# EAGLE design rp2040 solder kit v0.1 (EAGLE 9.5.2)
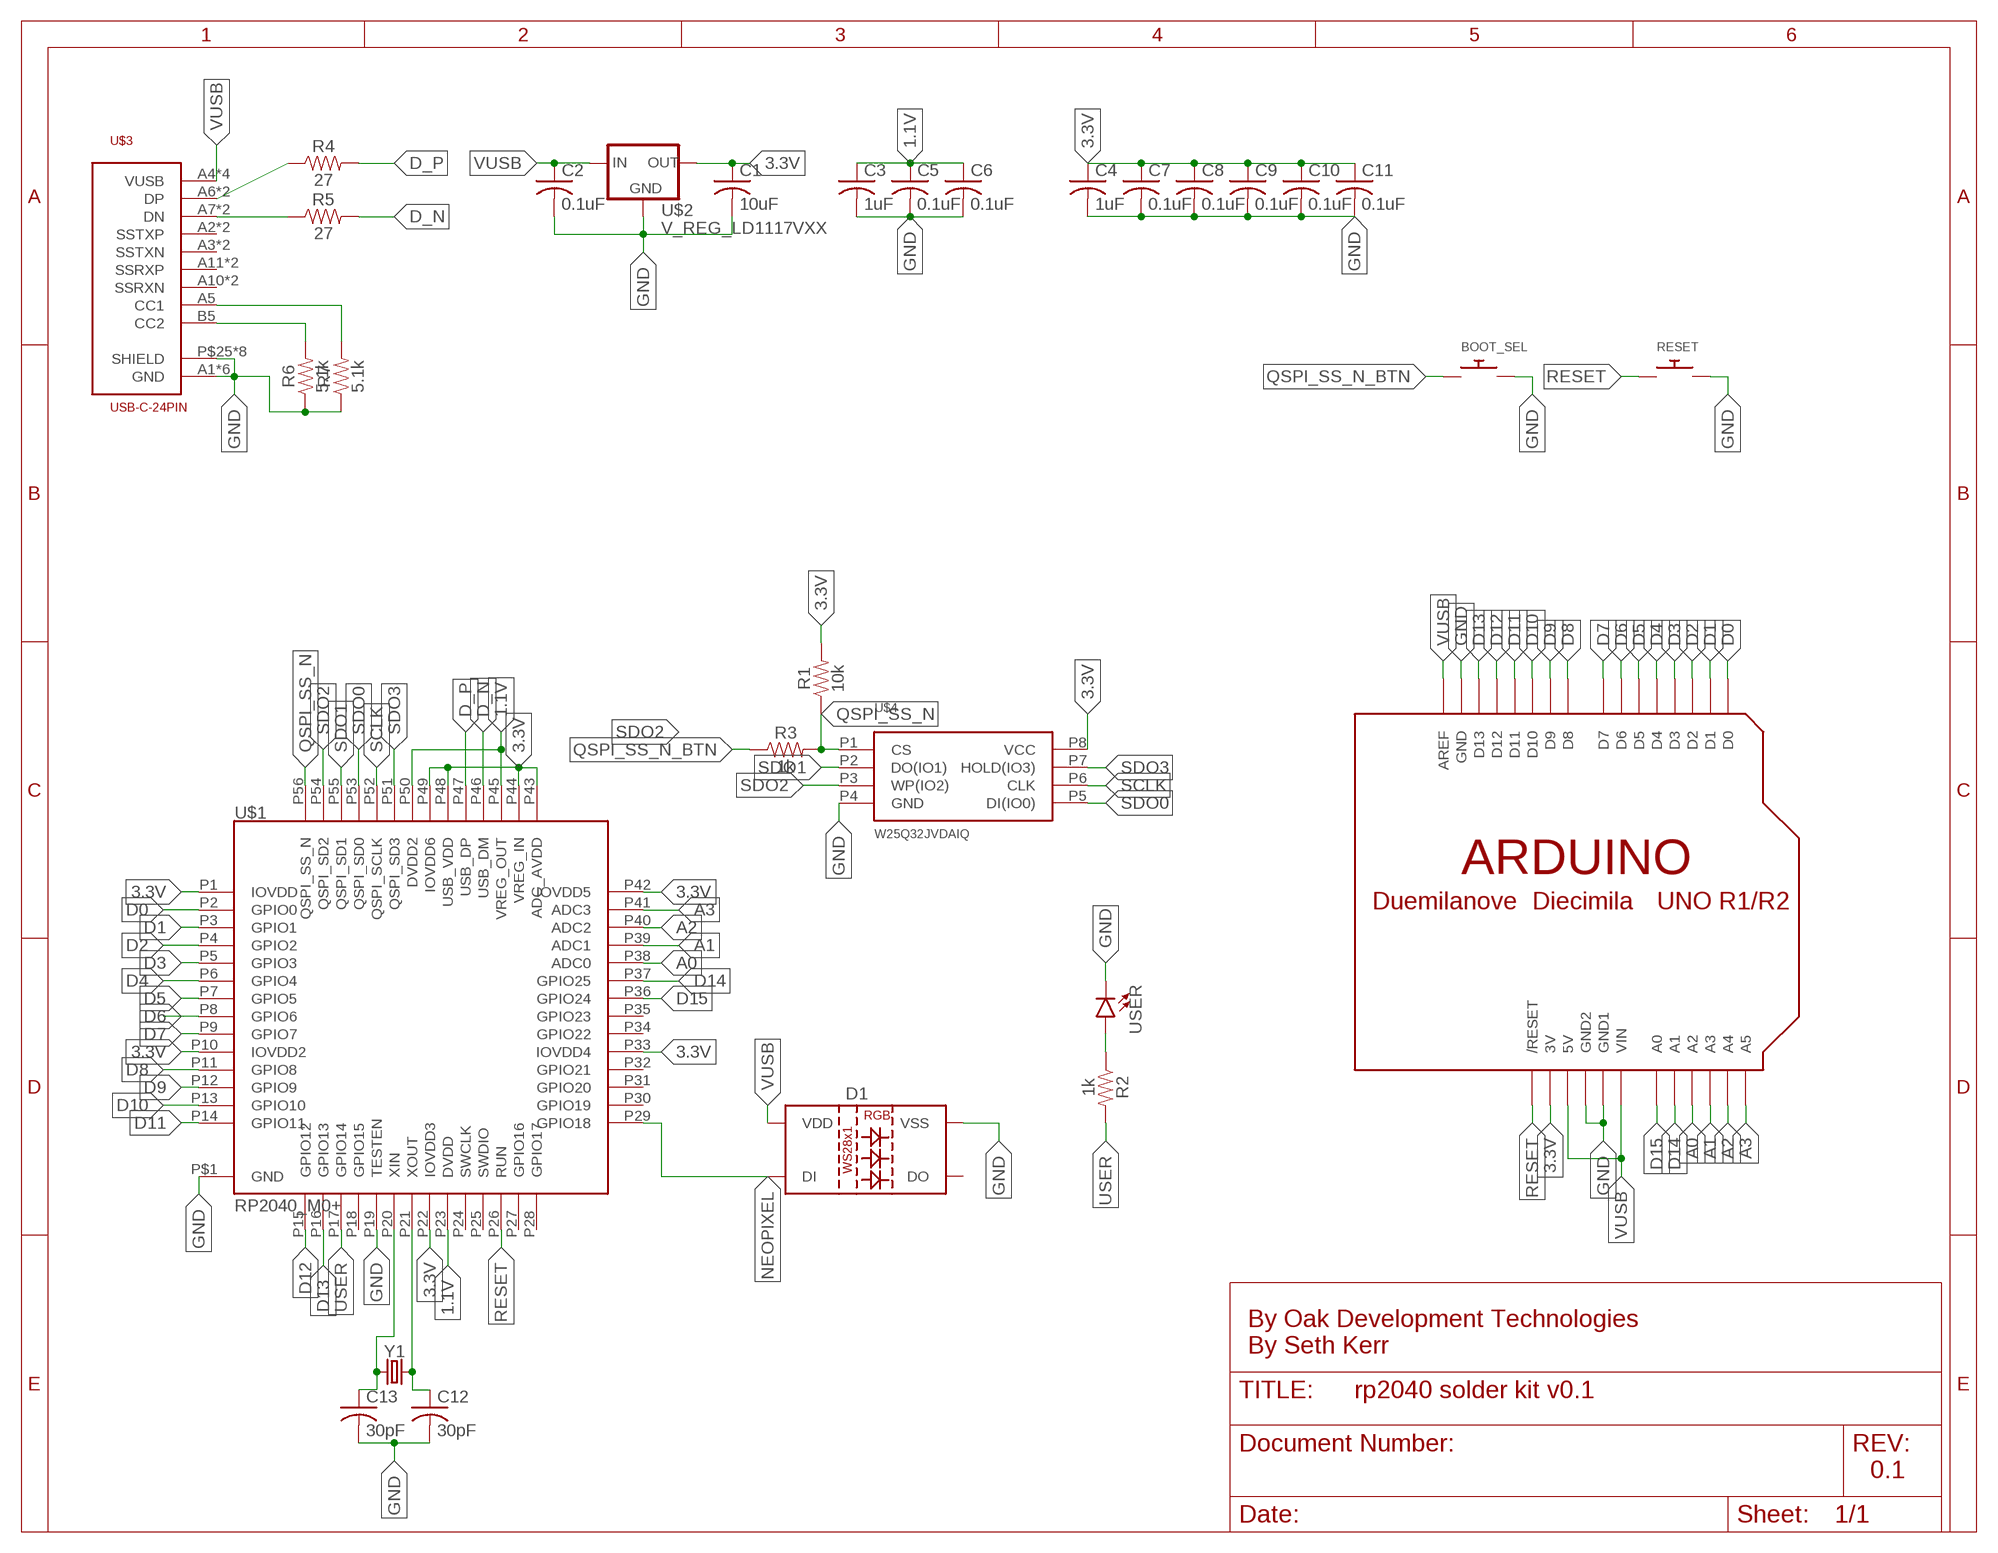
[diagram p0: schematic, sheet 1]

## Parts
BOOT_SEL  SWITCH_PUSHBUTTONEVQ-PE  [TACT_PANA-EVQ]
C1  10uF  C-US050-024X044  [C050-024X044]
C2  0.1uF  C-US050-024X044  [C050-024X044]
C3  1uF  C-US050-024X044  [C050-024X044]
C4  1uF  C-US050-024X044  [C050-024X044]
C5  0.1uF  C-US050-024X044  [C050-024X044]
C6  0.1uF  C-US050-024X044  [C050-024X044]
C7  0.1uF  C-US050-024X044  [C050-024X044]
C8  0.1uF  C-US050-024X044  [C050-024X044]
C9  0.1uF  C-US050-024X044  [C050-024X044]
C10  0.1uF  C-US050-024X044  [C050-024X044]
C11  0.1uF  C-US050-024X044  [C050-024X044]
C12  30pF  C-US050-024X044  [C050-024X044]
C13  30pF  C-US050-024X044  [C050-024X044]
D1  WS2812BWS2812B-3535  [WS2812-3535]
R1  10k  10KOHM-HORIZ-1/6W-5%  [AXIAL-0.3]
R2  1k  1KOHM-HORIZ-1/4W-1%  [AXIAL-0.3]
R3  1k  1KOHM-HORIZ-1/4W-5%  [AXIAL-0.3]
R4  27  RESISTORAXIAL-0.3  [AXIAL-0.3]
R5  27  RESISTORAXIAL-0.3  [AXIAL-0.3]
R6  5.1k  RESISTORAXIAL-0.3  [AXIAL-0.3]
R7  5.1k  RESISTORAXIAL-0.3  [AXIAL-0.3]
RESET  SWITCH_PUSHBUTTONEVQ-PE  [TACT_PANA-EVQ]
U$1  RP2040_M0+  [QFN-56]
U$2  V_REG_LD1117VXX  [78XXL]
U$3  USB-C-24PIN  [USB-C-TH]
U$4  W25Q32JVDAIQ  [PDIP-8]
U$5  ARDUINO-BPLACE  [ARDUINO-BPLACE]
USER  LED-5MM-KIT-NO-SILK  [LED_5MM-KIT-NO-SILK]
Y1  CRYSTALPTH-HC49US  [HC49US]

## Nets
1.1V: C3.1 C5.1 C6.1 U$1.P23(DVDD) U$1.P45(VREG_OUT) U$1.P50(DVDD2)
3.3V: C1.1 C4.1 C7.1 C8.1 C9.1 C10.1 C11.1 R1.P$2 U$1.P1(IOVDD) U$1.P10(IOVDD2) U$1.P22(IOVDD3) U$1.P33(IOVDD4) U$1.P42(IOVDD5) U$1.P43(ADC_AVDD) U$1.P44(VREG_IN) U$1.P48(USB_VDD) U$1.P49(IOVDD6) U$2.GND(OUT) U$4.P8(VCC) U$5.3V
A0: U$1.P38(ADC0) U$5.A2
A1: U$1.P39(ADC1) U$5.A3
A2: U$1.P40(ADC2) U$5.A4
A3: U$1.P41(ADC3) U$5.A5
D0: U$1.P2(GPIO0) U$5.D0
D1: U$1.P3(GPIO1) U$5.D1
D2: U$1.P4(GPIO2) U$5.D2
D3: U$1.P5(GPIO3) U$5.D3
D4: U$1.P6(GPIO4) U$5.D4
D5: U$1.P7(GPIO5) U$5.D5
D6: U$1.P8(GPIO6) U$5.D6
D7: U$1.P9(GPIO7) U$5.D7
D8: U$1.P11(GPIO8) U$5.D8
D9: U$1.P12(GPIO9) U$5.D9
D10: U$1.P13(GPIO10) U$5.D10
D11: U$1.P14(GPIO11) U$5.D11
D12: U$1.P15(GPIO12) U$5.D12
D13: U$1.P16(GPIO13) U$5.D13
D14: U$1.P37(GPIO25) U$5.A1
D15: U$1.P36(GPIO24) U$5.A0
D_N: R5.P$2 U$1.P46(USB_DM)
D_P: R4.P$2 U$1.P47(USB_DP)
GND: BOOT_SEL.P$2 C1.2 C2.2 C3.2 C4.2 C5.2 C6.2 C7.2 C8.2 C9.2 C10.2 C11.2 C12.2 C13.2 D1.VSS R6.P$1 R7.P$1 RESET.P$2 U$1.P19(TESTEN) U$1.P$1(GND) U$2.IN(GND) U$3.A1(GND) U$3.A8(GND) U$3.A12(GND) U$3.B1(GND) U$3.B8(GND) U$3.B12(GND) U$3.P$25(SHIELD) U$3.P$26(SHIELD) U$3.P$27(SHIELD) U$3.P$28(SHIELD) U$3.P$29(SHIELD) U$3.P$30(SHIELD) U$3.P$31(SHIELD) U$3.P$32(SHIELD) U$4.P4(GND) U$5.GND U$5.GND1 U$5.GND2 USER.K(C)
N$1: R7.P$2 U$3.A5(CC1)
N$2: R6.P$2 U$3.B5(CC2)
N$3: C12.1 U$1.P21(XOUT) Y1.2
N$4: R4.P$1 U$3.A6(DP) U$3.B6(DP)
N$5: R5.P$1 U$3.A7(DN) U$3.B7(DN)
N$6: R2.P$1 USER.A
N$7: C13.1 U$1.P20(XIN) Y1.1
NEOPIXEL: D1.DIN(DI) U$1.P29(GPIO18)
QSPI_SS_N: R1.P$1 R3.P$2 U$1.P56(QSPI_SS_N) U$4.P1(CS)
QSPI_SS_N_BTN: BOOT_SEL.P$1 R3.P$1
RESET: RESET.P$1 U$1.P26(RUN) U$5.RESET(/RESET)
SCLK: U$1.P52(QSPI_SCLK) U$4.P6(CLK)
SDO0: U$1.P53(QSPI_SD0) U$4.P5(DI(IO0))
SDO1: U$1.P55(QSPI_SD1) U$4.P2(DO(IO1))
SDO2: U$1.P54(QSPI_SD2) U$4.P3(WP(IO2))
SDO3: U$1.P51(QSPI_SD3) U$4.P7(HOLD(IO3))
USER: R2.P$2 U$1.P17(GPIO14)
VUSB: C2.1 D1.VDD U$2.OUT(IN) U$3.A4(VUSB) U$3.A9(VUSB) U$3.B4(VUSB) U$3.B9(VUSB) U$5.5V U$5.AREF U$5.VIN
Unconnected: D1.DOUT(DO) U$1.P18(GPIO15) U$1.P24(SWCLK) U$1.P25(SWDIO) U$1.P27(GPIO16) U$1.P28(GPIO17) U$1.P30(GPIO19) U$1.P31(GPIO20) U$1.P32(GPIO21) U$1.P34(GPIO22) U$1.P35(GPIO23) U$3.A2(SSTXP) U$3.A3(SSTXN) U$3.A10(SSRXN) U$3.A11(SSRXP) U$3.B2(SSTXP) U$3.B3(SSTXN) U$3.B10(SSRXN) U$3.B11(SSRXP)

## Notes on the sheet
- By Oak Development Technologies
  By Seth Kerr
- 0.1

## Library data of the parts
BOOT_SEL RESET = adafruit:SWITCH_PUSHBUTTON: Buttons SOFTTOUCHSMD_SJ - Soft touch temporary push button (Super Junk Akihabara) Compatible with SKPMANE010 [Mouser: 688-SKPMAN] C&K_KSS = Digikey: KSS221GLFS
C1-C13 = rcl:C-US: CAPACITOR, American symbol; SPICEPREFIX: C
D1 = SparkFun-LED:WS2812B: WS2812B SMD addressable RGB LED 5x5mm SMD LED with built-in controller IC. Color: Red/Green/Blue mC Rating: RGB: 390, 660, 180 mcd Forward Voltage: RGB: 2.0, 3.0, 3.0 V Packages:WS2812B SparkFun Products: Blynk Board - ESP8266 <https://www.sparkfun.com/products/13794>
R1 = SparkFun-Resistors:10KOHM: 10kΩ resistor A resistor is a passive two-terminal electrical component that implements electrical resistance as a circuit element. Resistors act to reduce current flow, and, at the same time, act to lower voltage levels within circuits. - Wikipedia; PROD_ID: RES-08375
R2 = SparkFun-Resistors:1KOHM: 1kΩ resistor A resistor is a passive two-terminal electrical component that implements electrical resistance as a circuit element. Resistors act to reduce current flow, and, at the same time, act to lower voltage levels within circuits. - Wikipedia; PROD_ID: RES-12182
R3 = SparkFun-Resistors:1KOHM: 1kΩ resistor A resistor is a passive two-terminal electrical component that implements electrical resistance as a circuit element. Resistors act to reduce current flow, and, at the same time, act to lower voltage levels within circuits. - Wikipedia; PROD_ID: RES-08380
R4-R7 = SparkFun-Resistors:RESISTOR: Generic Resistor Package
U$1 = RP2040_M0:RP2040_M0+
U$2 = SparkFun-IC-Power:V_REG_LD1117VXX: LD1117VXX voltage regulator. We carry the 3.3V version (COM-00526) in TO-220 package.
U$3 = USB connectors:USB-C-24PIN
U$4 = Winbond SPI Flash:W25Q32JVDAIQ
U$5 = adafruit:ARDUINO: Arduino Diecimila/Duemilanove Make a shield with ease, this package has all the named pins as well as the two mounting drill holes and an outline of the USB and DC power connector. The outline is on the DIMENSION layer, so if your board house uses it they will cut the outline to match. http://www.ladyada.net/library/pcb/eaglelibrary.html
USER = SparkFun-LED:LED: LED (Generic) Standard schematic elements and footprints for 5mm, 3mm, 1206, and 0603 sized LEDs. Generic LEDs with no color specified.
Y1 = SparkFun-Clocks:CRYSTAL: Crystals (Generic) These are passive quartz crystals, which can be used as a clock source for a microcontroller. Crystal's are two-terminal devices. They require external "load" capacitors to generate an oscillating signal.

## Board
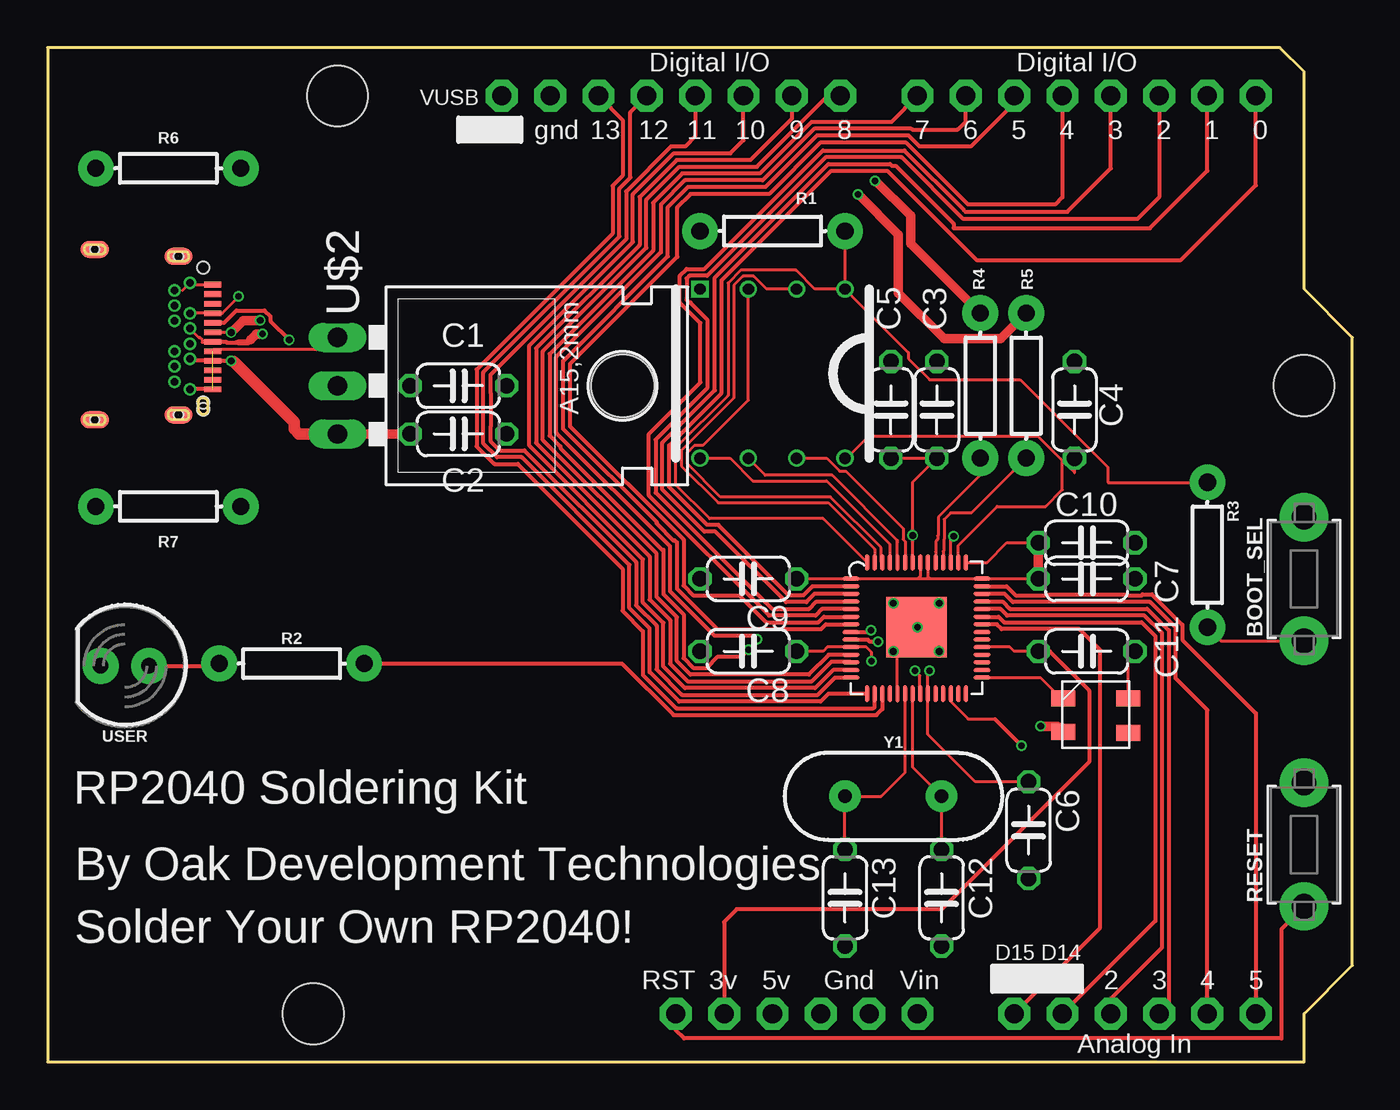
[diagram p1: board, top side]
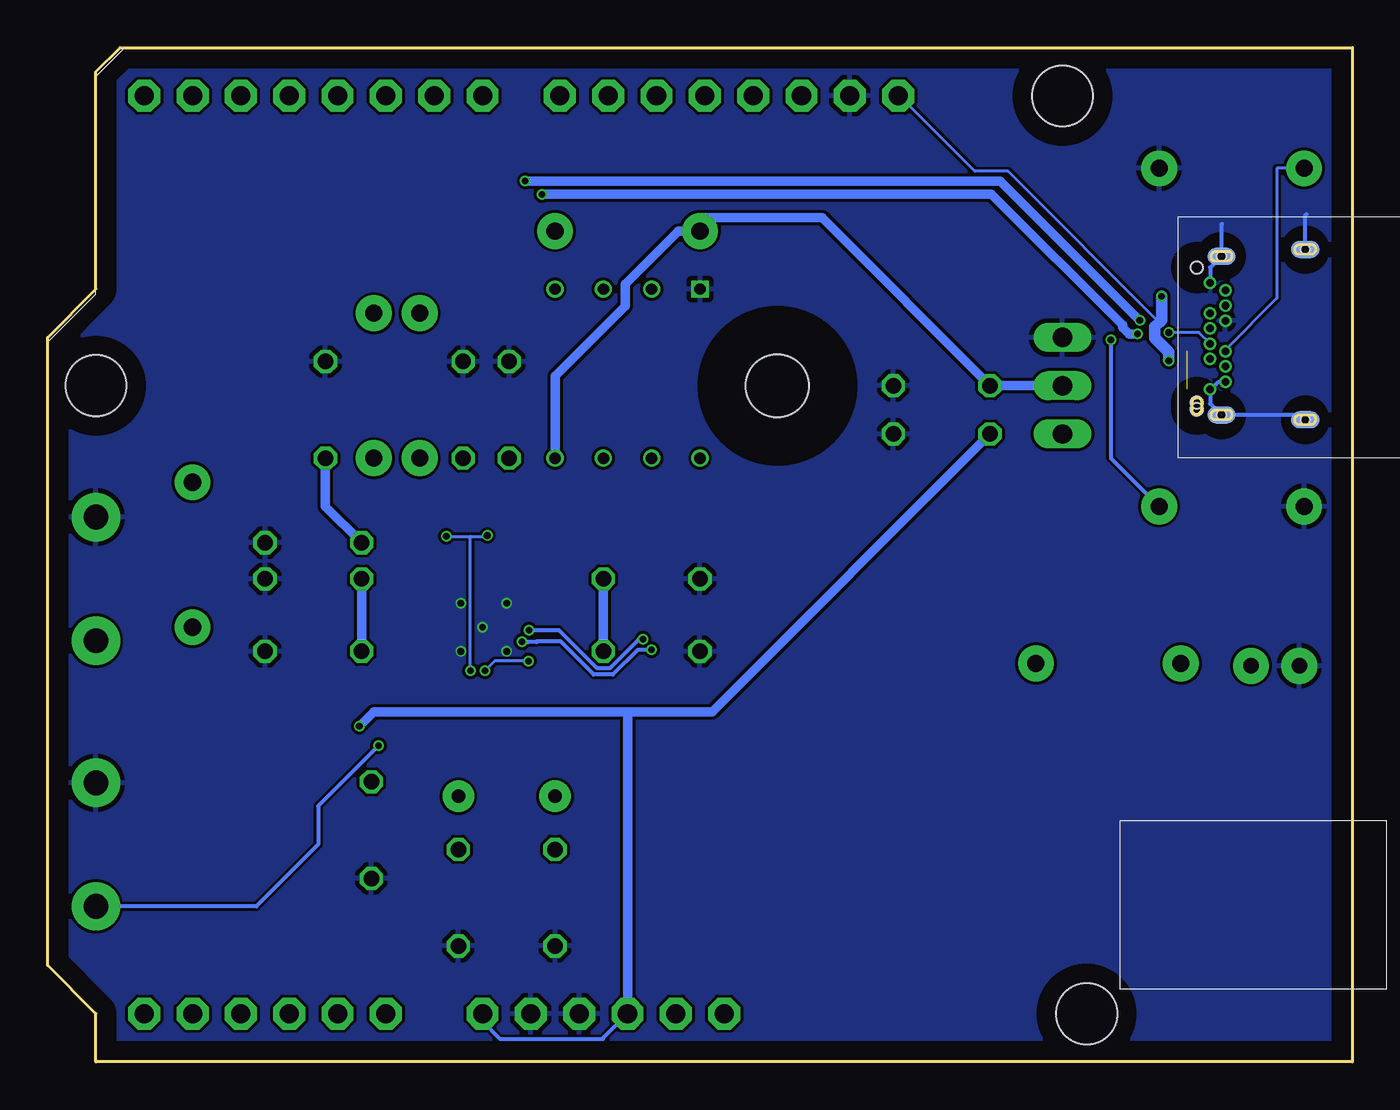
[diagram p2: board, bottom side, seen from below]

Size 68.58 x 53.34 mm. Coordinates in mm from the lower left corner, seen from the top.
Outline: 0,0 66.04,0 66.04,2.54 68.58,5.08 68.58,38.1 66.04,40.64 66.04,52.07 64.77,53.34 0,53.34 0,0
Copper layers (1*16): Top 0.035mm / dielectric 1.5mm / Bottom 0.035mm
Design rules "default *": minimum track width 6mil, minimum drill 0.35mm, track to track 6mil, track to pad 6mil, pad to pad 6mil, via to via 6mil, smd to smd 6mil, copper to edge 40mil, drill to drill 6mil, minimum pad ring 5mil, minimum via ring 4mil, stop-mask expansion 4mil, vias tented up to drill 15mil, thermal gap 10mil

### Footprints (pad centres in the part's own frame; a part is rotated, then mirrored left to right if it is on the bottom)
TACT_PANA-EVQ = drill 1.3 pad 2.54: P$1 -3.25,0; P$2 3.25,0
C050-024X044 = drill 0.813 octagon: 1 -2.54,0; 2 2.54,0
WS2812-3535 = smd 1.27 x 0.85: DIN 0.05,2.6; DOUT 3.45,0.8; VDD 0.05,0.85; VSS 3.45,2.6
AXIAL-0.3 = drill 0.9 pad 1.88: P$1 -3.81,0; P$2 3.81,0
QFN-56 = smd 0.875 x 0.2: P1 -3.5,2.55; P2 -3.5,2.15; P3 -3.5,1.75; P4 -3.5,1.35; P5 -3.5,0.95; P6 -3.5,0.55; P7 -3.5,0.15; P8 -3.5,-0.25; P9 -3.5,-0.65; P10 -3.5,-1.05; P11 -3.5,-1.45; P12 -3.5,-1.85; P13 -3.5,-2.25; P14 -3.5,-2.65; P29 3.4,-2.65; P30 3.4,-2.25; P31 3.4,-1.85; P32 3.4,-1.45; P33 3.4,-1.05; P34 3.4,-0.65; P35 3.4,-0.25; P36 3.4,0.15; P37 3.4,0.55; P38 3.4,0.95; P39 3.4,1.35; P40 3.4,1.75; P41 3.4,2.15; P42 3.4,2.55 | smd 0.2 x 0.875: P15 -2.65,-3.5; P16 -2.25,-3.5; P17 -1.85,-3.5; P18 -1.45,-3.5; P19 -1.05,-3.5; P20 -0.65,-3.5; P21 -0.25,-3.5; P22 0.15,-3.5; P23 0.55,-3.5; P24 0.95,-3.5; P25 1.35,-3.5; P26 1.75,-3.5; P27 2.15,-3.5; P28 2.55,-3.5; P43 2.55,3.4; P44 2.15,3.4; P45 1.75,3.4; P46 1.35,3.4; P47 0.95,3.4; P48 0.55,3.4; P49 0.15,3.4; P50 -0.25,3.4; P51 -0.65,3.4; P52 -1.05,3.4; P53 -1.45,3.4; P54 -1.85,3.4; P55 -2.25,3.4; P56 -2.65,3.4 | smd 3.2 x 3.2: P$1 -0.05,0
78XXL = drill 1.016 long: GND 0,-3.81; IN -2.54,-3.81; OUT 2.54,-3.81 | hole 3.302: 0,11.176
USB-C-TH = smd 0.3 x 0.9: A1 -1.5,3.6; A2 -1,3.6; A3 -0.5,3.6; A4 0,3.6; A5 0.5,3.6; A6 1,3.6; A7 1.5,3.6; A8 2,3.6; A9 2.5,3.6; A10 3,3.6; A11 3.5,3.6; A12 4,3.6 | drill 0.4 pad 0.65: B1 4,2.4; B2 3.6,1.6; B3 2.8,1.6; B4 2.4,2.4; B5 2,1.6; B6 1.6,2.4; B7 0.8,2.4; B8 0.4,1.6; B9 0,2.4; B10 -0.4,1.6; B11 -1.2,1.6; B12 -1.6,2.4 | smd 0.9 x 1.5: P$25 -3,1.8; P$26 5.35,1.8; P$27 -3.35,-2.6; P$28 5.6,-2.6 | smd 0.9 x 1.5 bottom: P$29 -3,1.8; P$30 -3.35,-2.6; P$31 5.35,1.8; P$32 5.6,-2.6 | hole 0.65: -2.4,3.1; 4.7,3.1; 5.05,3.1 | hole 0.5: -3,1.8; -3.35,-2.6; 5.6,-2.6; 5.35,1.8
PDIP-8 = drill 0.6: P1 -2.54,2.54; P2 -2.54,0; P3 -2.54,-2.54; P5 6.35,-5.08; P6 6.35,-2.54; P7 6.35,0; P8 6.35,2.54 | drill 0.6 square: P4 -2.54,-5.08
ARDUINO-BPLACE = drill 1 pad 1.676 octagon: 3V 35.56,2.54; 5V 38.1,2.54; A0 50.8,2.54; A1 53.34,2.54; A2 55.88,2.54; A3 58.42,2.54; A4 60.96,2.54; A5 63.5,2.54; AREF 23.876,50.8; D0 63.5,50.8; D1 60.96,50.8; D2 58.42,50.8; D3 55.88,50.8; D4 53.34,50.8; D5 50.8,50.8; D6 48.26,50.8; D7 45.72,50.8; D8 41.656,50.8; D9 39.116,50.8; D10 36.576,50.8; D11 34.036,50.8; D12 31.496,50.8; D13 28.956,50.8; GND 26.416,50.8; GND1 43.18,2.54; GND2 40.64,2.54; RESET 33.02,2.54; VIN 45.72,2.54 | hole 3.2: 15.24,50.8; 66.04,35.56; 13.97,2.54
LED_5MM-KIT-NO-SILK = drill 0.813 pad 1.88: A -1.27,0; K 1.27,0
HC49US = drill 0.7 pad 1.651: 1 -2.54,0; 2 2.54,0

### Placement (x,y rotation side)
BOOT_SEL  66.04,25.4 90 top
C1  21.59,35.56 0 top
C2  21.59,33.02 0 top
C3  46.74,34.29 90 top
C4  53.98,34.29 90 top
C5  44.32,34.29 90 top
C6  51.56,12.19 270 top
C7  54.61,25.4 0 top
C8  36.83,21.59 180 top
C9  36.83,25.4 180 top
C10  54.61,27.3 0 top
C11  54.61,21.59 0 top
C12  46.99,8.64 270 top
C13  41.91,8.64 270 top
D1  53.34,16.51 0 top
R1  38.1,43.69 180 top
R2  12.83,20.95 0 top
R3  60.96,26.67 90 top
R4  49.02,35.56 270 top
R5  51.44,35.56 270 top
R6  6.35,46.99 180 top
R7  6.35,29.21 0 top
RESET  66.04,11.43 90 top
U$1  45.72,22.86 0 top
U$2  19.05,35.56 270 top
U$3  5.08,39.37 270 top
U$4  39.37,38.1 270 top
U$5  0,0 0 top
USER  4.06,20.83 180 top
Y1  44.45,13.97 0 top

### Tracks (layer width: path | path; a pad name or v marks a point on that pad's centre or on a via)
1.1V  (via drill 0.35)
  Top 0.152: C6.1 48.77,14.73 46.27,17.23 U$1.P23 46.27,20.49 v46.35,20.57 | U$1.P50 v45.47,27.69 45.47,30.48 C3.1 C5.1 | U$1.P45 47.47,27.48 v47.62,27.64
  Bottom 0.152: v47.62,27.64 46.35,27.64 | 46.35,27.64 45.52,27.64 v45.47,27.69 | v46.35,20.57 46.35,27.64
3.3V  (via drill 0.35)
  Top 0.152: C11.1 50.8,21.59 50.58,21.81 U$1.P33 | C7.1 U$1.P42 46.35,25.41 | U$1.P43 49.37,26.26 50.42,27.3 C10.1 | U$1.P44 47.87,27.17 49.91,29.21 52.45,29.21 53.34,30.1 53.34,31.62 | C4.1 53.98,30.99 53.34,31.62 | U$4.P8 41.99,31.75 43.16,32.92 52.05,32.92 53.34,31.62 | C8.1 40.77,21.59 40.99,21.81 U$1.P10 43.04,21.81 43.31,21.54 v43.31,21.08 | C9.1 U$1.P1 45.73,25.41 | U$1.P22 45.85,19.38 45.85,20.32 v45.59,20.57 | U$1.P49 45.87,25.55 45.73,25.41 | 45.73,25.41 46.35,25.41 | U$1.P48 46.27,25.5 46.35,25.41
  Top 0.203: C11.1 52.68,21.59 54.74,19.53 54.74,15.77 46.99,8.03 36.22,8.03 35.56,7.37 U$5.3V
  Top 0.508: C10.1 C7.1
  Bottom 0.152: v43.31,21.08 45.09,21.08 v45.59,20.57
  Bottom 0.508: U$2.GND C1.1 27.88,44.39 34.35,44.39 34.29,44.32 R1.P$2 35.43,43.69 38.23,40.89 38.23,39.75 41.91,36.07 U$4.P8 | C4.1 53.98,29.21 C10.1 | C7.1 C11.1 | C9.1 C8.1
A0
  Top 0.203: U$5.A2 55.88,3.33 58.57,6.02 58.57,22.55 57.65,23.47 50.43,23.47 50.09,23.81 U$1.P38
A1
  Top 0.203: U$1.P39 50.2,24.21 50.58,23.82 57.8,23.82 58.93,22.69 58.93,3.05 U$5.A3
A2
  Top 0.203: U$5.A4 60.96,18.5 59.28,20.18 59.28,22.84 57.94,24.18 50.73,24.18 50.3,24.61 U$1.P40
A3
  Top 0.203: U$1.P41 50.4,25.01 50.88,24.54 52.43,24.54 52.48,24.59 56.74,24.59 56.79,24.54 57.51,24.54 57.56,24.59 58.04,24.59 59.64,22.99 59.64,22.2 63.5,18.34 U$5.A5
D0
  Top 0.203: U$1.P2 40.2,25.01 39.73,24.54 38.96,24.54 35.26,28.25 34.66,28.25 32.67,30.23 32.67,32.42 35.43,35.18 35.43,41.1 41.19,46.86 44.13,46.86 48.82,42.16 59.56,42.16 63.5,46.1 U$5.D0
D1
  Top 0.203: U$1.P3 40.3,24.61 39.88,24.18 38.81,24.18 35.1,27.89 34.51,27.89 32.32,30.09 32.32,32.57 35.08,35.33 35.08,41.25 41.04,47.21 44.28,47.21 44.37,47.12 44.58,47.12 47.62,44.07 47.62,43.87 47.65,43.84 57.94,43.84 60.96,46.86 U$5.D1
D2
  Top 0.203: U$5.D2 58.42,45.47 57.28,44.32 48.13,44.32 44.89,47.57 40.9,47.57 34.67,41.34 33.73,41.34 33.59,41.2 33.59,40.09 33.73,39.94 33.78,39.94 34.67,39.05 34.67,35.43 31.96,32.72 31.96,29.94 38.08,23.82 40.02,23.82 40.41,24.21 U$1.P4
D3
  Top 0.203: U$1.P5 40.7,23.81 40.36,23.47 37.93,23.47 31.61,29.79 31.61,33.02 34.31,35.73 34.31,38.85 33.23,39.94 33.23,41.34 33.59,41.7 34.52,41.7 40.75,47.93 45.03,47.93 48.13,44.83 48.26,44.7 53.59,44.7 55.88,46.99 U$5.D3
D4
  Top 0.203: U$5.D4 53.34,45.47 52.96,45.09 48.38,45.09 45.14,48.33 40.61,48.33 37.92,45.64 33.8,45.64 33.1,44.94 33.1,42.35 27.46,36.71 27.46,33.44 33.43,27.47 33.43,25.04 33.93,24.54 36.36,24.54 37.78,23.11 40.51,23.11 40.8,23.41 U$1.P6
D5
  Top 0.203: U$5.D5 50.8,50.42 48.51,48.13 45.84,48.13 45.26,48.71 40.44,48.71 37.72,46 33.65,46 32.61,44.96 32.61,42.36 27.1,36.85 27.1,33.29 32,28.39 32,28.32 32.89,27.43 32.96,27.43 33.07,27.32 33.07,24.89 35.21,22.76 40.66,22.76 40.91,23.01 U$1.P7
D6  (via drill 0.35)
  Top 0.203: U$1.P8 43.18,22.61 v43.28,22.71 | v37.29,22.23 37.11,22.4 35.06,22.4 32.72,24.75 32.72,27.11 26.75,33.08 26.75,37.08 32.23,42.57 32.23,45.09 33.5,46.35 37.58,46.35 40.29,49.07 45.41,49.07 45.45,49.02 47.83,49.02 48.26,49.45 U$5.D6
  Bottom 0.203: v43.28,22.71 41.71,22.71 39.73,20.73 39.01,20.73 37.51,22.23 v37.29,22.23
D7  (via drill 0.35)
  Top 0.203: U$5.D7 44.34,49.42 40.14,49.42 37.43,46.71 33.35,46.71 31.83,45.18 31.83,42.67 26.39,37.23 26.39,32.93 26.95,32.37 26.95,32.28 32.31,26.92 32.36,26.92 32.36,24.6 33.43,23.53 33.43,21.23 33.93,20.73 34.65,20.73 35.23,21.31 36.47,21.31 v36.84,21.68 | v43.64,22.1 43.22,22.1 43.11,22.2 U$1.P9
  Bottom 0.203: v36.84,21.68 37.56,21.68 38.87,20.37 39.88,20.37 41.62,22.11 42.85,22.11 42.88,22.07 43.32,22.07 43.35,22.1 v43.64,22.1
D8
  Top 0.203: U$1.P11 41.58,21.41 41.06,21.41 40.02,20.37 33.78,20.37 33.07,21.09 33.07,23.39 32,24.45 32,26.73 26.04,32.7 26.04,37.38 31.47,42.81 31.47,45.33 33.21,47.07 37.28,47.07 41.02,50.8 U$5.D8
D9
  Top 0.203: U$5.D9 39.12,49.61 36.93,47.42 33.06,47.42 31.11,45.48 31.11,42.96 25.68,37.53 25.68,32.55 31.65,26.58 31.65,24.31 32.72,23.24 32.72,20.94 33.64,20.02 40.16,20.02 41.2,21.06 41.43,21.06 41.44,21.05 42.18,21.05 U$1.P12
D10
  Top 0.203: U$1.P13 41.29,20.61 40.34,19.66 33.49,19.66 32.36,20.79 32.36,23.09 31.29,24.16 31.29,26.43 25.32,32.4 25.32,37.67 30.76,43.11 30.76,45.62 32.91,47.78 35.89,47.78 36.58,48.46 U$5.D10
D11
  Top 0.203: U$5.D11 34.04,48.67 33.5,48.13 32.76,48.13 30.4,45.77 30.4,43.26 23.27,36.12 23.27,35.2 23.29,35.18 23.29,33.4 23.27,33.38 23.27,32.66 23.77,32.16 25.07,32.16 30.94,26.28 30.94,24.01 32,22.94 32,20.64 33.34,19.3 40.48,19.3 41.39,20.21 U$1.P14
D12
  Top 0.203: U$1.P15 41.04,19.36 40.63,18.95 33.2,18.95 31.65,20.5 31.65,22.8 30.58,23.86 30.58,26.14 24.92,31.8 23.62,31.8 22.91,32.52 22.91,36.27 30.05,43.4 30.05,45.92 30.63,46.5 30.63,49.94 U$5.D12
D13
  Top 0.203: U$5.D13 30.23,49.53 30.23,46.6 29.69,46.07 29.69,43.55 22.55,36.41 22.55,32.37 23.48,31.45 24.71,31.45 30.23,25.93 30.23,23.72 31.29,22.65 31.29,20.35 33.05,18.59 43.41,18.59 43.47,18.65 U$1.P16
D14
  Top 0.203: U$1.P37 49.99,23.41 50.29,23.11 57.5,23.11 58.22,22.4 58.22,7.42 U$5.A1
D15
  Top 0.203: U$5.A0 55.32,7.06 55.32,21.67 54.23,22.76 50.14,22.76 49.89,23.01 U$1.P36
D_N
  Top 0.152: R5.P$2 48.55,28.87 47.46,28.87 47.12,28.52 47.12,27.49 47.11,27.48 47.11,26.88 47.07,26.84 U$1.P46
D_P
  Top 0.152: R4.P$2 49.02,30.86 46.81,28.65 46.81,27.69 46.78,27.66 46.78,27.48 46.69,27.39 46.69,26.85 46.67,26.83 U$1.P47
GND  (via drill 0.35)  (5 unrouted)
  Top 0.152: U$3.A1 7.58,40.87 U$3.B12 7.08,40.57 | D1.VSS 56.79,21.23 C11.2 | U$1.P19 44.67,21.86 U$1.P$1 | U$2.IN 14.61,37.47 8.73,37.47 U$3.A8 | C6.2 51.56,9.14
  Top 0.203: U$3.A12 U$3.B1 | U$1.P$1 44.45,24.08 v44.45,24.13 | U$1.P$1 46.86,24.05 v46.86,24.13 | U$1.P$1 46.86,21.67 v46.86,21.59
  Bottom 0.203: U$3.B12 7.48,41.77 U$3.P$29 6.88,44.05 6.86,44.07 | U$3.P$30 2.48,44.51 2.41,44.58 | U$3.P$32 2.73,34.02 U$3.P$31 7.48,34.62 U$3.B1 7.42,35.37 7.02,35.77
  other vias: 44.45,21.59 45.72,22.86
  pour Bottom: -3.81,57.15 71.12,57.15 71.12,-1.27 -3.81,-1.27
N$1  (via drill 0.35)
  Top 0.203: U$3.A5 9.28,38.87 9.93,39.52 11.4,39.52 11.71,39.21 11.71,38.97 v12.7,37.97
  Bottom 0.203: v12.7,37.97 12.7,31.75 R7.P$2
N$2
  Bottom 0.152: R6.P$2 3.97,46.99 3.97,40.16 6.67,37.47 U$3.B5
N$3
  Top 0.152: U$1.P21 45.47,15.49 Y1.2 C12.1
N$4  (via drill 0.35)
  Top 0.152: v9.65,38.35 8.7,38.35 U$3.A6
  Top 0.508: R4.P$1 45.36,43.03 45.36,44.49 43.53,46.33 v43.48,46.33 | v9.65,38.35 10.29,38.99 v11.18,38.99
  Bottom 0.152: U$3.B6 8.06,38.35 v9.65,38.35
  Bottom 0.508: v11.18,38.99 18.51,46.33 v43.48,46.33
N$5  (via drill 0.35)
  Top 0.152: U$3.B7 7.95,38.1 8,38.1 8.13,37.97 8.13,37.85 8.66,37.85 U$3.A7
  Top 0.203: U$3.A7 9.39,37.87 9.43,37.82 9.87,37.82 9.89,37.85 10.03,37.85
  Top 0.305: 10.03,37.85 10.54,37.85 10.67,37.97
  Top 0.508: v42.6,45.62 44.7,43.51 44.7,40.44 47.12,38.02 50.09,38.02 R5.P$1 | v11.3,38.28 10.98,38.28 10.67,37.97
  Bottom 0.508: v42.6,45.62 42.39,45.62 42.37,45.64 18.97,45.64 12.06,38.73 12.06,38.61 11.74,38.28 v11.3,38.28
N$6
  Top 0.203: USER.A 8.89,20.83 R2.P$1
N$7
  Top 0.152: U$1.P20 45.07,15.22 43.81,13.97 Y1.1 C13.1
NEOPIXEL
  Top 0.152: U$1.P29 52.18,20.21 53.28,19.11 D1.DIN
QSPI_SS_N
  Top 0.152: U$1.P56 40.76,28.57 34.8,28.57 33,30.37 33,32.28 35.76,35.05 35.76,40.96 36.42,41.62 39.35,41.62 40.33,40.64 U$4.P1 | R1.P$1 U$4.P1 | U$4.P1 45.24,37.31 45.24,36.99 46.35,35.88 51.12,35.88 55.72,31.27 55.72,30.48 R3.P$2
QSPI_SS_N_BTN
  Top 0.152: BOOT_SEL.P$1 61.67,22.15 R3.P$1
RESET  (via drill 0.35)
  Top 0.152: 49.78,18.03 48.39,18.03 47.47,18.95 U$1.P26
  Top 0.203: 49.78,18.03 v51.18,16.64 | RESET.P$1 64.85,6.99 64.85,1.25 33.45,1.25 33.02,1.68 U$5.RESET
  Bottom 0.203: v51.18,16.64 54.36,13.46 54.36,11.43 57.61,8.18 RESET.P$1
SCLK
  Top 0.152: U$1.P52 44.67,27.34 44.66,27.35 44.66,27.43 41.23,30.86 37.72,30.86 U$4.P6
SDO0
  Top 0.152: U$4.P5 35.87,31.75 37.06,30.56 40.95,30.56 44.27,27.23 U$1.P53
SDO1
  Top 0.152: U$4.P2 37.79,40.64 37.11,41.32 36.55,41.32 36.07,40.84 36.07,34.92 33.31,32.16 33.31,31.34 35.24,29.41 41.02,29.41 43.47,26.96 U$1.P55
SDO2
  Top 0.152: U$1.P54 43.81,26.32 43.81,27.05 41.15,29.72 35.36,29.72 33.61,31.47 33.61,32.03 34.01,32.43 34.46,32.43 36.83,34.8 U$4.P3
SDO3
  Top 0.152: U$4.P7 40.95,31.75 41.63,31.07 41.95,31.07 44.97,28.06 44.97,27.48 45.07,27.37 U$1.P51
USER
  Top 0.203: R2.P$2 30.18,20.95 32.9,18.24 43.56,18.24 43.88,18.56 U$1.P17
VUSB  (via drill 0.35)
  Top 0.152: U$3.B9 U$3.A4 9.19,39.37 10.03,40.22 v10.03,40.26
  Top 0.203: 9.78,36.83 9.74,36.87 v9.65,36.87 U$3.A9 7.58,36.87 U$3.B4
  Top 0.508: U$2.OUT 15.62,33.02 C2.1 | v52.2,17.65 53.1,17.65 D1.VDD
  Top 0.61: 9.78,36.83 12.95,33.66 12.95,33.27 13.21,33.02 15.62,33.02
  Bottom 0.152: 10.15,38.89 18.1,46.83 19.84,46.83 23.81,50.8 U$5.AREF
  Bottom 0.203: U$5.5V 39.4,1.25 39.4,1.19 44.78,1.19 45.72,2.13 U$5.VIN
  Bottom 0.508: C2.1 33.66,18.41 38.25,18.41 | v52.2,17.65 51.44,18.41 38.25,18.41 | U$5.5V 38.1,18.26 38.25,18.41
  Bottom 0.61: v9.65,36.87 9.65,37.32 10.39,38.05 10.39,38.66 10.15,38.89 10.03,39.01 v10.03,40.26

### Text on the board
tPlace: VUSB | RP2040 Soldering Kit | By Oak Development Technologies | Solder Your Own RP2040! | D15 D14